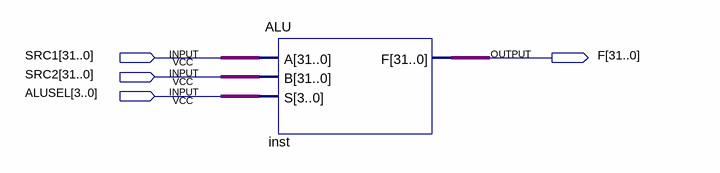
[diagram p0: schematic sheet]
// Quartus schematic execute.bdf as structural Verilog: 1 symbols, 4 pins
module execute (
  input  [31:0] SRC1,
  input  [31:0] SRC2,
  input  [3:0] ALUSEL,
  output [31:0] F
);

  ALU inst (.A(SRC1), .B(SRC2), .S(ALUSEL), .F(F));
endmodule
